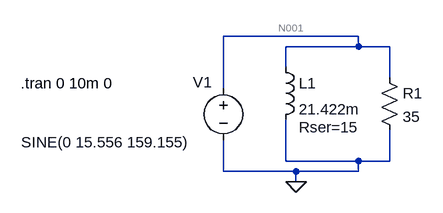
[diagram p0: schematic 1_8.asc]
1_8.asc, the LTspice schematic file:
Version 4.1
SHEET 1 880 680
WIRE 384 0 176 0
WIRE 384 16 384 0
WIRE 384 16 272 16
WIRE 432 16 384 16
WIRE 272 48 272 16
WIRE 432 64 432 16
WIRE 176 80 176 0
WIRE 272 192 272 128
WIRE 384 192 272 192
WIRE 432 192 432 144
WIRE 432 192 384 192
WIRE 176 208 176 160
WIRE 288 208 176 208
WIRE 384 208 384 192
WIRE 384 208 288 208
WIRE 288 224 288 208
FLAG 288 224 0
SYMBOL voltage 176 64 R0
WINDOW 123 0 0 Left 0
WINDOW 39 24 124 Left 2
WINDOW 0 -47 7 Left 2
WINDOW 3 -311 99 Left 2
SYMATTR InstName V1
SYMATTR Value SINE(0 15.556 159.155)
SYMBOL res 416 48 R0
SYMATTR InstName R1
SYMATTR Value 35
SYMBOL ind 256 32 R0
WINDOW 39 36 108 Left 2
SYMATTR SpiceLine Rser=15
SYMATTR InstName L1
SYMATTR Value 21.422m
TEXT -136 72 Left 2 !.tran 0 10m 0

The netlist it stands for:
* 1_8.asc
V1 N001 0 SINE(0 15.556 159.155)
R1 N001 0 35
L1 N001 0 21.422m Rser=15
.tran 0 10m 0
.backanno
.end

* Results of the author's LTspice run, read from the files saved beside the schematic
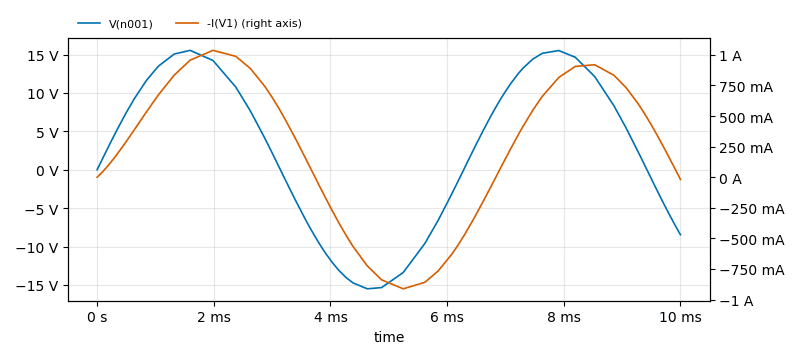
[diagram p1: Transient Analysis of 1_8.asc, plotted from the saved traces]
* Transient Analysis, 1 run:
*   V(n001): min -15.51 V, max 15.55 V, average 2.84 V, rms 10.71 V, last -8.463 V
*   -I(V1): min -911.8 mA, max 1.037 A, average 239.4 mA, rms 670.2 mA, last -18.12 mA